# Altium schematic sheet Half_bridge_load.SchDoc: Half Bridge and Load
size Letter; Engineer: Nikhil Deshpande; Revision: A; SheetNumber: 2; SheetTotal: 3
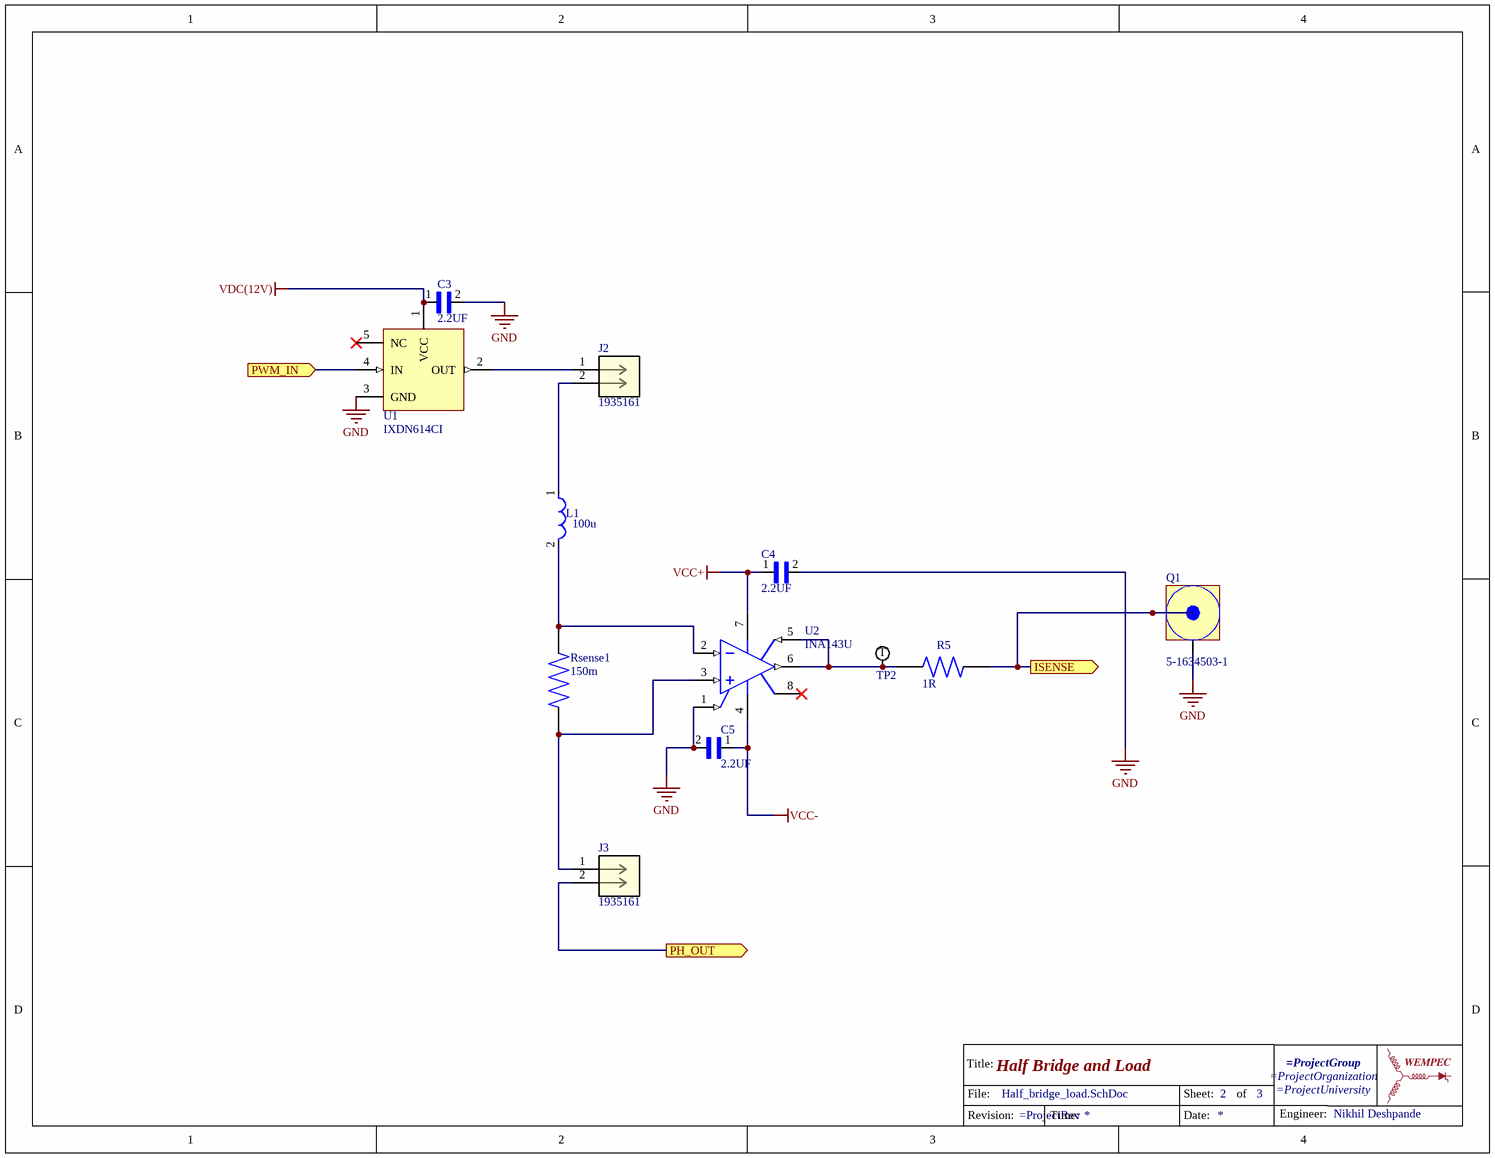
[diagram p0: Half_bridge_load.SchDoc]

## Parts
C3  2.2UF  [0603_CAP]
C4  2.2UF  [0603_CAP]
C5  2.2UF  [0603_CAP]
J2  1935161  [PHOENIX_1935161]
J3  1935161  [PHOENIX_1935161]
L1  100u  [FP-PA4344_104NLT-MFG]
Q1  5-1634503-1  [5-1634503-1]
R5  1R  [0603_RES]
Rsense1  150m  [RES_15_OHM]
TitleBlockWEMPEC2  TitleBlockWEMPEC  (value not drawn)
TP2  Test Point  [TP_1.6MM]  (value not drawn)
U1  IXDN614CI  [IXYS_TO-220-5_IXY]
U2  INA143U  [SOIC127P599X175-8N]

## Ports
ISENSE (out), PH_OUT (out), PWM_IN (in)

## Nets
GND: C3.2 C4.2 C5.2 Q1.2 U1.3(GND) U2.1(REF)
VCC+: C4.1 U2.7(V+)
VCC-: C5.1 U2.4(V-)
VDC(12V): C3.1 U1.1(VCC)
ISENSE: Q1.1 R5.2 ; port ISENSE
PH_OUT: J3.2 ; port PH_OUT
PWM_IN: U1.4(IN) ; port PWM_IN
NetJ2_1: J2.1 U1.2(OUT)
NetJ2_2: J2.2 L1.1
NetJ3_1: J3.1 Rsense1.2 U2.3(IN+)
NetL1_2: L1.2 Rsense1.1 U2.2(IN-)
NetR5_1: R5.1 TP2.1 U2.5(SENSE) U2.6(OUTPUT)

Not connected (* = marked no-connect by the designer): U1 5(NC)*; U2 8(NC)*

## Notes on the sheet
- (in symbol Test Point 36-5005ND) T
- (in symbol TitleBlockWEMPEC) Title:; File:; Sheet:; of; Engineer:; Revision:; Time:; Date:

## Library data of the parts
C3-C5 = GRM188R6YA225MA12D: CAP CER 2.2UF 35V X5R 0603; Manufacturer: Murata; Tolerance: 20%; Supplier 1: Digi-Key; Manufacturer Part Number: GRM188R6YA225MA12D; RoHS: Yes; Category: Ceramic Capacitors; Pricing 1: 1=0.20000, 10=0.14000, 50=0.07960, 100=0.06600, 500=0.04630, 1000=0.03833 (USD); Mount: Surface Mount; Case/Package: 0603; Case Code (Metric): 1608; Case Code (Imperial): 0603; Weight: 0.000222oz; Min Operating Temperature: -55°C; Max Operating Temperature: 85°C; Capacitance: 2.2uF; Packaging: Tape and Reel; Voltage Rating: 35V; Dielectric: X5R; Termination: SMD/SMT; Voltage Rating (DC): 35V; Package Quantity: 4000; Length: 0.063inch; Width: 0.031inch; Height: 0.8mm; Thickness: 0.035inch; RoHS Compliant: Yes; ComponentLink1URL: http://www.mouser.com/ds/2/281/c02e-2905.pdf?src-supplier=Mouser; ComponentLink1Description: http://www.mouser.com/ds/2/281/c02e-2905.pdf?src-supplier=Mouser; ComponentLink2URL: http://search.murata.co.jp/Ceramy/image/img/A01X/G101/ENG/GRM188R6YA225MA12-01.pdf?src-supplier=Digi-Key; ComponentLink2Description: http://search.murata.co.jp/Ceramy/image/img/A01X/G101/ENG/GRM188R6YA225MA12-01.pdf?src-supplier=Digi-Key; Supplier Part Number 1: 490-10486-1-ND
J2 J3 = 1935161: Conn Terminal Blocks 2 POS 5mm Solder ST Thru-Hole 16A; Manufacturer: Phoenix Contact; Max Supply Voltage: 250V; Current Rating: 17.5A; Number of Poles: 2; Number of Levels: 1; Current: 18A; Voltage: 300V; Voltage Rating (DC): 320V; Connector Type: Screw; Wire Gauge (Max): 26AWG; Wire Gauge (Min): 12AWG; Approvals: UL; Supplier 1: Digi-Key; Manufacturer Part Number: 1935161; RoHS: Yes; Category: Terminal Blocks; Stock 1: 82071; Pricing 1: 1=0.43000, 10=0.41400, 50=0.39600, 100=0.38520, 250=0.36000, 500=0.33120, 1000=0.30600 (USD); Mount: Through Hole; Number of Pins: 2; Color: Green; Weight: 0.067021oz; Material: Nylon; Housing Color: Green; Housing Material: Polyamide; Insulation Material: Nylon; Contact Material: Copper,Tin; Number of Rows: 1; Max Current Rating: 16A; Voltage Rating: 250V; Package Quantity: 250; Packaging: Bulk; Number of Positions: 2; Number of Positions Per Level: 2; Termination: Solder; Number of Contacts: 2; Number of Circuits: 2; Orientation: Straight; Series: COMBICON PT; Number of Ways: 2; Length: 9mm; Width: 14.9mm; Height: 11.3mm; Pitch: 5mm; Depth: 9mm; Wire/Cable Gauge: 26AWG; Radiation Hardening: No; Lead Free: Lead Free; Flammability Rating: UL94 V-0; REACH SVHC: Unknown; RoHS Compliant: Yes; ComponentLink1URL: https://datasheet.ciiva.com/15169/getdatasheetpartid-177903-15169663.pdf?src-supplier=Verical; ComponentLink1Description: https://datasheet.ciiva.com/15169/getdatasheetpartid-177903-15169663.pdf?src-supplier=Verical; ComponentLink2URL: https://datasheet.ciiva.com/16047/1935161-16047247.pdf?src-supplier=Onlinecomponents.com; ComponentLink2Description: https://datasheet.ciiva.com/16047/1935161-16047247.pdf?src-supplier=Onlinecomponents.com; ComponentLink3URL: https://datasheet.ciiva.com/824/combiconcompact5-0mmseries-824222.pdf?src-supplier=Digi-Key; ComponentLink3Description: https://datasheet.ciiva.com/824/combiconcompact5-0mmseries-824222.pdf?src-supplier=Digi-Key; Supplier Part Number 1: 277-1667-ND
L1 = PA4344.104NLT: FIXED IND 100UH 5.3A 118 MOHM; Manufacturer: Pulse; Saturation Current: 6.5A; Shielding: Shielded; DC Resistance (DCR): 118mR; Test Frequency: 100kHz; Supplier 1: Digi-Key; Manufacturer Part Number: PA4344.104NLT; RoHS: Yes; Category: Fixed Inductors; Stock 1: 1739; Pricing 1: 1=3.77000, 10=3.59600, 25=3.42480, 50=2.87700, 100=2.46600 (USD); Mount: Surface Mount; Case/Package: Nonstandard; Min Operating Temperature: -40°C; Max Operating Temperature: 125°C; Packaging: Tape and Reel; Inductance: 100uH; Current Rating: 5.3A; Length: 0.697inch; Width: 0.677inch; Height - Seated (Max): 0.276inch; Ratings: AEC-Q200; RoHS Compliant: Yes; ComponentLink1URL: http://productfinder.pulseeng.com/products/datasheets/P771.pdf?src-supplier=Digi-Key; ComponentLink1Description: http://productfinder.pulseeng.com/products/datasheets/P771.pdf?src-supplier=Digi-Key; Supplier Part Number 1: 553-3011-1-ND
Q1 = 5-1634503-1: CONN BNC JACK STR 50 OHM PCB; Supplier 1: Digi-Key; Supplier Part Number 1: A97581-ND
R5 = RCG06031R00FKEA: RES SMD 1 OHM 1% 1/10W 0603; Manufacturer: Vishay Dale; Voltage Rating: 75V; Power Rating: 100mW; Temperature Coefficient: 100ppm/°C; Supplier 1: Digi-Key; Manufacturer Part Number: RCG06031R00FKEA; RoHS: Yes; Category: Chip SMD Resistors; Stock 1: 8700; Pricing 1: 1=0.16000, 10=0.14500, 100=0.05580, 1000=0.02454, 2500=0.02120 (USD); Case/Package: 0603; Weight: 7.1E-05oz; Case Code (Metric): 1608; Case Code (Imperial): 0603; Min Operating Temperature: -55°C; Max Operating Temperature: 155°C; Packaging: Tape and Reel; Package Quantity: 5000; Resistance: 1R; Tolerance: 1%; Resistor Type: Thick Film; Number of Terminations: 2; Max Power Dissipation: 100mW; Length: 0.061inch; Width: 0.033inch; Height: 0.02inch; RoHS Compliant: Yes; ComponentLink1URL: https://datasheet.ciiva.com/18596/rcge3-18596758.pdf?src-supplier=Digi-Key; ComponentLink1Description: https://datasheet.ciiva.com/18596/rcge3-18596758.pdf?src-supplier=Digi-Key; Supplier Part Number 1: 541-1776-1-ND
Rsense1 = 15FR150E: Resistor; Wirewound; Res 0.15 Ohms; Pwr-Rtg 5 W; Tol 1%; Axial; Silicone; Cur-Sense; Manufacturer: Ohmite; Resistance: 150mR; Power Rating: 5W; Voltage Rating: 100mV; Temperature Coefficient: 50ppm/°C; Voltage Rating (DC): 1kV; Lead Diameter: 0.05mm; Lead Length: 39.7mm; Body Diameter: 8.4mm; Body Length: 23.8mm; Supplier 1: Digi-Key; Manufacturer Part Number: 15FR150E; RoHS: Yes; Category: Through-Hole Resistors; Stock 1: 1147; Pricing 1: 1=3.11000, 10=2.77800, 25=2.61080, 50=2.38860, 100=2.05540, 250=1.77760, 500=1.61096, 1000=1.41652, 5000=1.36653 (USD); Mount: Through Hole; Case/Package: Axial; Number of Pins: 2; Min Operating Temperature: -55°C; Max Operating Temperature: 275°C; Tolerance: 1%; Package Quantity: 10; Packaging: Bulk; Termination: Axial; Resistor Type: Wirewound; Number of Terminations: 2; Max Power Dissipation: 5W; Series: 10; Resistance Tolerance: 1%; Diameter: 8.4mm; Length: 23.8mm; Lead Free: Lead Free; ComponentLink1URL: https://datasheet.ciiva.com/2716/res-10-2716526.pdf?src-supplier=Digi-Key; ComponentLink1Description: https://datasheet.ciiva.com/2716/res-10-2716526.pdf?src-supplier=Digi-Key; ComponentLink2URL: https://datasheet.ciiva.com/16771/70022566-16771081.pdf?src-supplier=Allied+Electronics; ComponentLink2Description: https://datasheet.ciiva.com/16771/70022566-16771081.pdf?src-supplier=Allied+Electronics; ComponentLink3URL: https://datasheet.ciiva.com/1131/66208-1131710.pdf?src-supplier=Element14; ComponentLink3Description: https://datasheet.ciiva.com/1131/66208-1131710.pdf?src-supplier=Element14; Supplier Part Number 1: 15FR150E-ND
TP2 = Test Point 36-5005ND: Conn Test Point SKT 1 POS ST Thru-Hole 1 Port; Material - Insulation: No Insulation; Body Material: PBT; Number of Ports: 1; Inside Diameter: 1.78mm; Outside Diameter: 3.18mm; Hole Diameter: 1.6mm; Supplier Part Number: *; Supplier: *; Footprint: *; RoHS: RoHS Compliant; Category: Test and Measurement; Stock 1: 136646; Pricing 1: 1=0.22, 10=0.206, 25=0.1756, 50=0.1536, 100=0.1426, 250=0.12616, 500=0.12068, 1000=0.09874 (USD); Packaging: Cut Tape (CT); Part Status: Active; Type: PC Test Point; Mounting Type: Surface Mount; Color: Natural; Size / Dimension: 0.063" x 0.031" x 0.045" (1.60mm x 0.80mm x 1.15mm); Plating: -; Material - Body: -; ComponentLink1URL: http://www.te.com/commerce/DocumentDelivery/DDEController?Action=srchrtrv&DocNm=1773266&DocType=DS&DocLang=English; ComponentLink1Description: http://www.te.com/commerce/DocumentDelivery/DDEController?Action=srchrtrv&DocNm=1773266&DocType=DS&DocLang=English; Stock 2: 147226; Pricing 2: 1=0.42000, 25=0.34080, 100=0.30150, 250=0.28304, 500=0.25230, 1000=0.19884, 2500=0.18180, 5000=0.17044 (USD); Mount: PCB,Through Hole; Contact Material: Bronze; Contact Plating: Silver,Tin; Material: Nylon,Bronze,Silver; Housing Color: Red; Termination: Solder; Orientation: Straight; Series: THM; Package Quantity: 100; Length: 8.89mm; Height: 0.35inch; Lead Free: Lead Free; REACH SVHC: No SVHC; Flammability Rating: UL94 V-0; RoHS Compliant: Yes; ComponentLink2URL: https://datasheet.ciiva.com/11744/0900766b8009b7c7-11744948.pdf?src-supplier=RSComponents; ComponentLink2Description: https://datasheet.ciiva.com/11744/0900766b8009b7c7-11744948.pdf?src-supplier=RSComponents; ComponentLink3URL: https://datasheet.ciiva.com/2917/m60-2p60-2917633.pdf?src-supplier=Digi-Key; ComponentLink3Description: https://datasheet.ciiva.com/2917/m60-2p60-2917633.pdf?src-supplier=Digi-Key; ComponentLink4URL: https://datasheet.ciiva.com/16508/m60-2p60-16508073.pdf?src-supplier=Future+Electronics; ComponentLink4Description: https://datasheet.ciiva.com/16508/m60-2p60-16508073.pdf?src-supplier=Future+Electronics; ComponentLink5URL: https://datasheet.ciiva.com/1454/1703983-1454828.pdf?src-supplier=Element14; ComponentLink5Description: https://datasheet.ciiva.com/1454/1703983-1454828.pdf?src-supplier=Element14; ComponentLink6URL: https://datasheet.ciiva.com/16883/70182825-16883781.pdf?src-supplier=Allied+Electronics; ComponentLink6Description: https://datasheet.ciiva.com/16883/70182825-16883781.pdf?src-supplier=Allied+Electronics; Supplier 1: Digi-Key; Supplier Part Number 1: 36-5005-ND
U1 = IXDN614CI: 14-Ampere Low-Side Ultrafast MOSFET Driver 5-Lead TO-220; Manufacturer: IXYS; Number of Outputs: 1; Max Output Current: 14A; Max Supply Voltage: 35V; Rise Time: 35ns; Propagation Delay: 70ns; Min Supply Voltage: 4.5V; Fall Time: 25ns; Output Impedance: 1.5R; Supplier 1: Digi-Key; Manufacturer Part Number: IXDN614CI; RoHS: Yes; Category: Gate Drivers; Stock 1: 879; Pricing 1: 1=5.45000, 10=4.89400, 25=4.62640, 100=4.00960, 250=3.80396, 500=3.41328, 1000=2.90970 (USD); Mount: Through Hole; Case/Package: TO-220-5; Number of Pins: 5; Min Operating Temperature: -40°C; Max Operating Temperature: 125°C; Package Quantity: 50; Packaging: Rail/Tube; Number of Drivers: 1; Series: -; Lead Free: Lead Free; RoHS Compliant: Yes; ComponentLink1URL: https://datasheet.ciiva.com/6611/ixd-614-6611632.pdf?src-supplier=Digi-Key; ComponentLink1Description: https://datasheet.ciiva.com/6611/ixd-614-6611632.pdf?src-supplier=Digi-Key; ComponentLink2URL: https://datasheet.ciiva.com/16352/ixd-614-r00h-16352558.pdf?src-supplier=Future+Electronics; ComponentLink2Description: https://datasheet.ciiva.com/16352/ixd-614-r00h-16352558.pdf?src-supplier=Future+Electronics; Supplier Part Number 1: IXDN614CI-ND
U2 = INA143U: SP Amp Difference Amplifier Single ±18V/36V 8-Pin SOIC Tube; Manufacturer: Texas Instruments; Dual Supply Voltage: 15V; Min Dual Supply Voltage: 2.25V; Max Dual Supply Voltage: 18V; Bandwidth: 150kHz; Nominal Supply Current: 950uA; Common Mode Rejection Ratio: 86dB; Number of Channels: 1; Slew Rate: 5V/µs; Max Supply Voltage: 36V; Min Supply Voltage: 4.5V; Input Offset Voltage (Vos): 100uV; Voltage Gain: 20dB; Input Resistance: 55kR; Output Current per Channel: 32mA; Settling Time: 6us; Supplier 1: Digi-Key; Manufacturer Part Number: INA143U; RoHS: Yes; Category: Amplifiers - Op Amps, Buffer, Instrumentation; Stock 1: 417; Pricing 1: 1=4.01000, 10=3.60000, 25=3.40320, 100=2.79830, 250=2.51096, 500=2.42020, 1000=2.01178, 2500=1.99780 (USD); Case/Package: D; Number of Pins: 8; Weight: 0.002677oz; Min Operating Temperature: -40°C; Max Operating Temperature: 85°C; Package Quantity: 75; Packaging: Rail/Tube; Number of Circuits: 1; Number of Elements: 1; Quiescent Current: 950uA; Gain Bandwidth Product: 150kHz; -3db Bandwidth: 150kHz; Operating Supply Current: 950uA; Max Input Voltage: 36V; Min Input Voltage: 2.25V; Number of Amplifiers: 1; Length: 4.9mm; Width: 3.91mm; Height: 1.58mm; Radiation Hardening: No; Lead Free: Lead Free; REACH SVHC: No SVHC; ComponentLink1URL: https://datasheet.ciiva.com/19474/1341122-19474592.pdf?src-supplier=Jameco; ComponentLink1Description: https://datasheet.ciiva.com/19474/1341122-19474592.pdf?src-supplier=Jameco; ComponentLink2URL: https://datasheet.ciiva.com/15128/getdatasheetpartid-49975-15128159.pdf?src-supplier=Verical; ComponentLink2Description: https://datasheet.ciiva.com/15128/getdatasheetpartid-49975-15128159.pdf?src-supplier=Verical; ComponentLink3URL: https://datasheet.ciiva.com/1799/ina143-1799971.pdf?src-supplier=Digi-Key; ComponentLink3Description: https://datasheet.ciiva.com/1799/ina143-1799971.pdf?src-supplier=Digi-Key; ComponentLink4URL: https://datasheet.ciiva.com/2976/ina2143-2976117.pdf?src-supplier=Avnet; ComponentLink4Description: https://datasheet.ciiva.com/2976/ina2143-2976117.pdf?src-supplier=Avnet; ComponentLink5URL: https://datasheet.ciiva.com/26191/sbos116-26191078.pdf?src-supplier=Avnet+Europe; ComponentLink5Description: https://datasheet.ciiva.com/26191/sbos116-26191078.pdf?src-supplier=Avnet+Europe; ComponentLink6URL: https://datasheet.ciiva.com/1485/693952-1485228.pdf?src-supplier=Element14; ComponentLink6Description: https://datasheet.ciiva.com/1485/693952-1485228.pdf?src-supplier=Element14; ComponentLink7URL: https://datasheet.ciiva.com/48707/001010602-da-01-en-ic-opamp-diff-150khz-ina143u-soic-8-tid-48707338.pdf?src-supplier=Conrad; ComponentLink7Description: https://datasheet.ciiva.com/48707/001010602-da-01-en-ic-opamp-diff-150khz-ina143u-soic-8-tid-48707338.pdf?src-supplier=Conrad; Supplier Part Number 1: INA143U-ND